# Altium schematic sheet ASB.SchDoc (part 1 of 3)
size A3
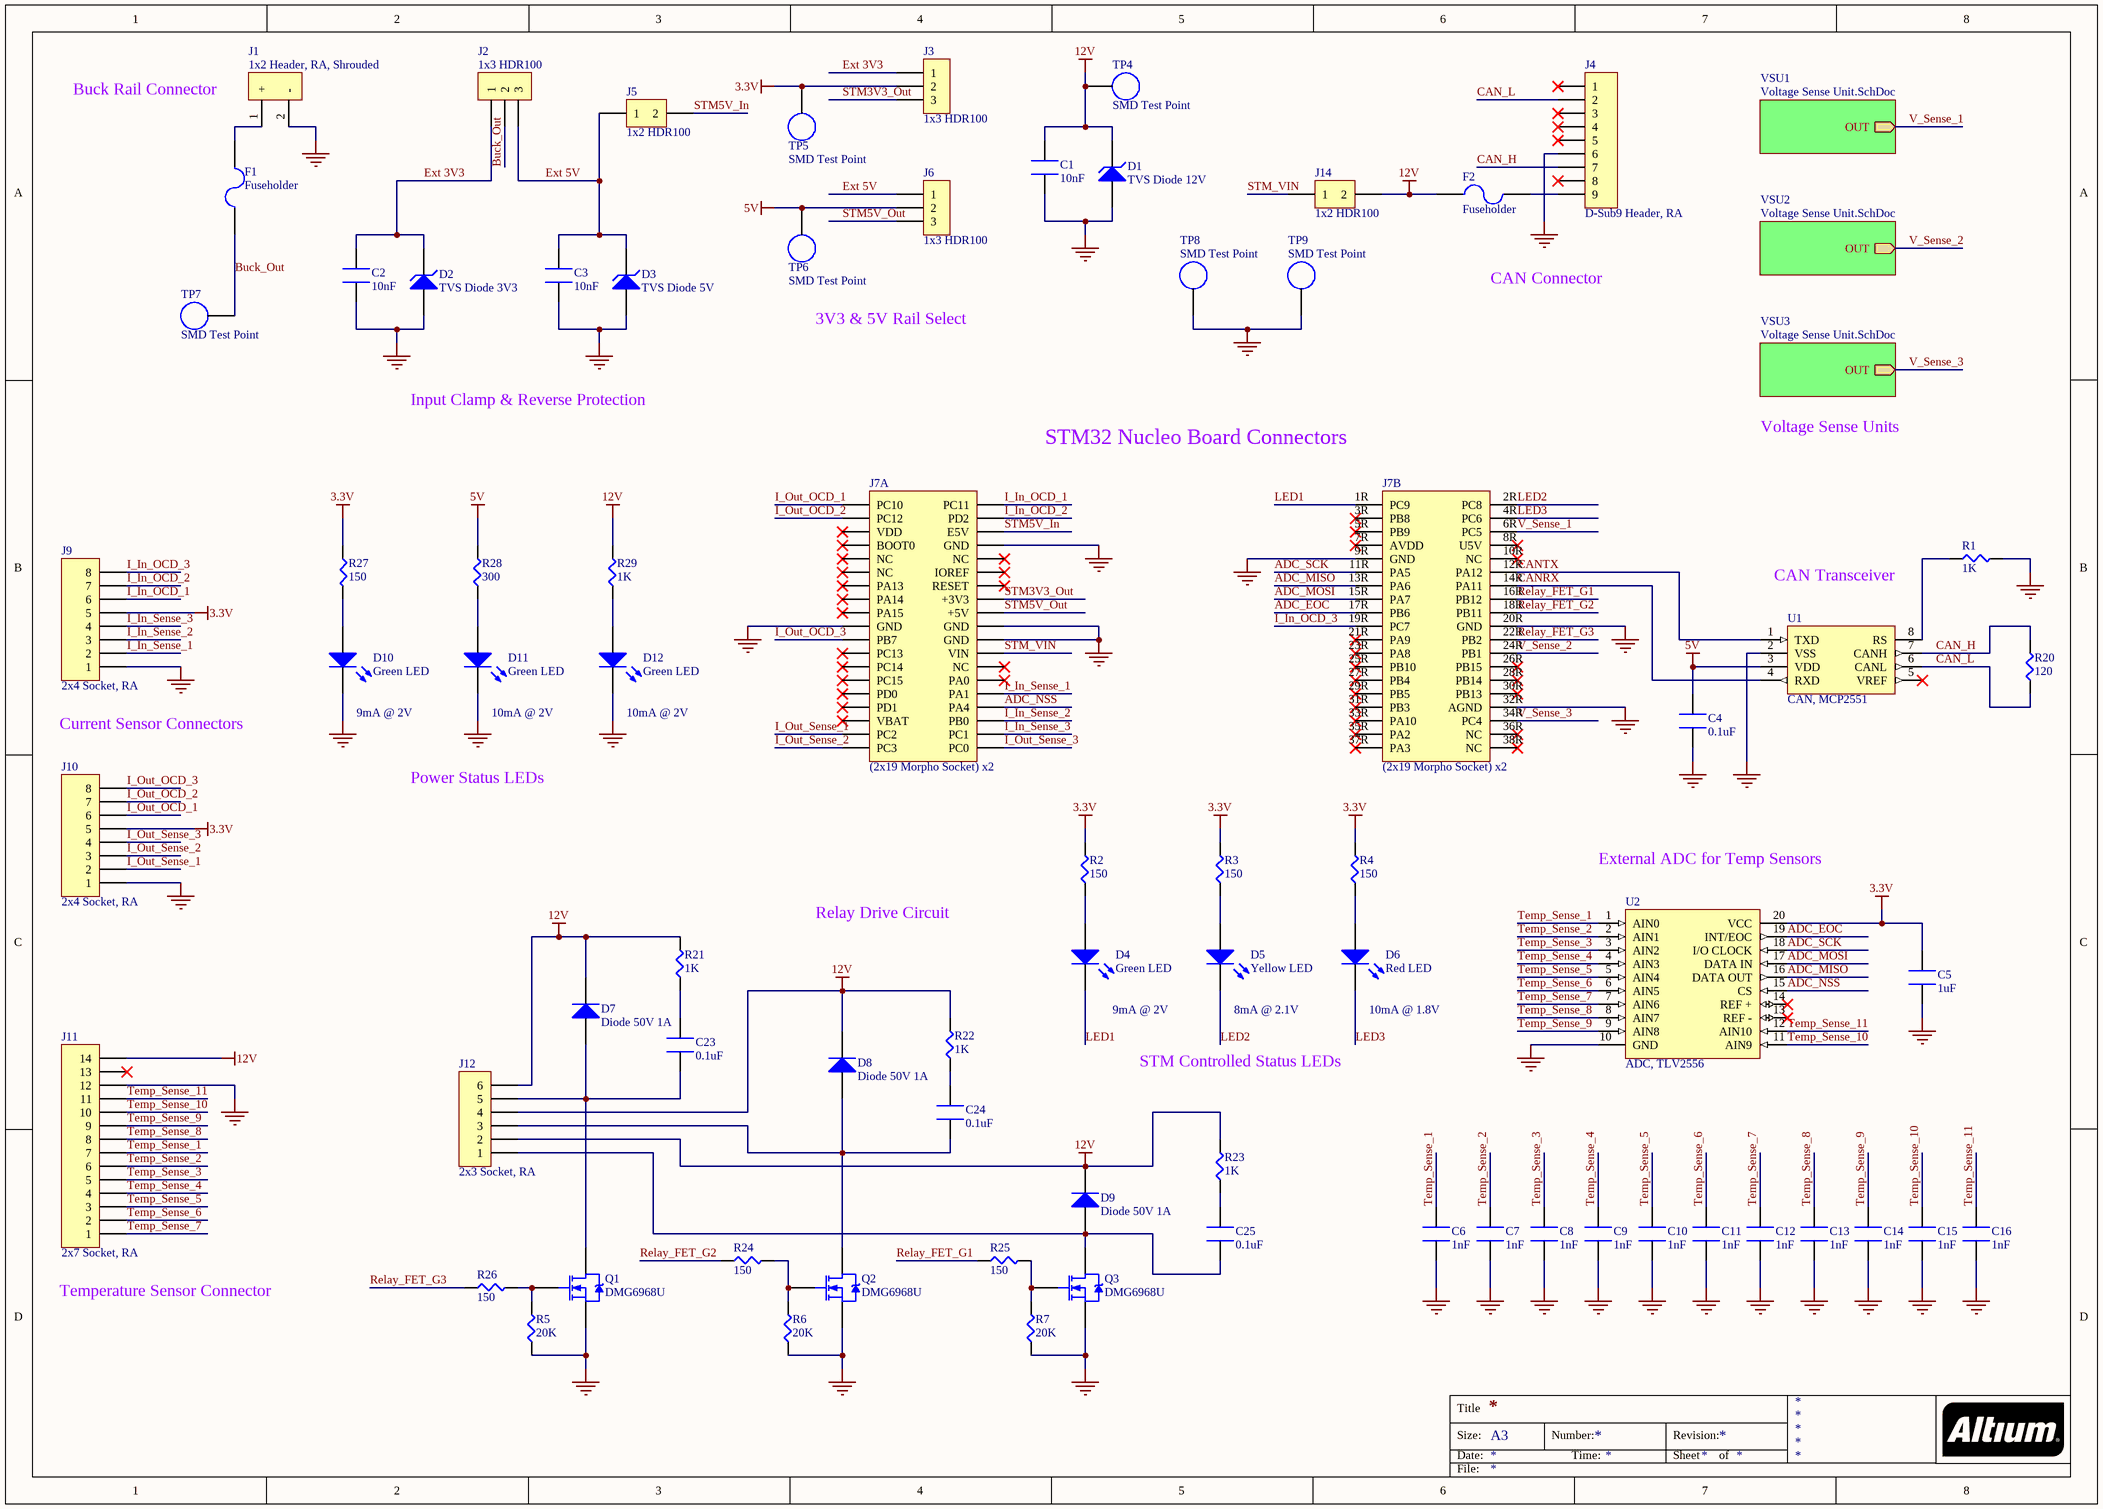
[diagram p0: ASB.SchDoc]

## Parts
C1  10nF  [C0805]
C2  10nF  [C0805]
C3  10nF  [C0805]
C4  0.1uF  [C0805]
C5  1uF  [C0805]
C6  1nF  [C0805]
C7  1nF  [C0805]
C8  1nF  [C0805]
C9  1nF  [C0805]
C10  1nF  [C0805]
C11  1nF  [C0805]
C12  1nF  [C0805]
C13  1nF  [C0805]
C14  1nF  [C0805]
C15  1nF  [C0805]
C16  1nF  [C0805]
C23  0.1uF  [C0805]
C24  0.1uF  [C0805]
C25  0.1uF  [C0805]
D1  TVS Diode 12V  [SOD-323]
D2  TVS Diode 3V3  [SOD-323]
D3  TVS Diode 5V  [SOD-323]
D4  Green LED  [L0805]
D5  Yellow LED  [L0805]
D6  Red LED  [L0805]
D7  Diode 50V 1A  [CGRKM4001-HF]
D8  Diode 50V 1A  [CGRKM4001-HF]
D9  Diode 50V 1A  [CGRKM4001-HF]
D10  Green LED  [L0805]
D11  Green LED  [L0805]
D12  Green LED  [L0805]
F1  Fuseholder  [SCHURTER - 0031.7701.11 - FUSE HOLDER, PCB MOUNT]
F2  Fuseholder  [SCHURTER - 0031.7701.11 - FUSE HOLDER, PCB MOUNT]
J1  1x2 Header, RA, Shrouded  [MOLEX_0705530001]
J2  1x3 HDR100  [MOLEX 0901200763]
J3  1x3 HDR100  [MOLEX 0901200763]
J4  D-Sub9 Header, RA  [D9 Connector]
J5  1x2 HDR100  [Molex 0901200762]
J6  1x3 HDR100  [MOLEX 0901200763]
J7  (2x19 Morpho Socket) x2  [STM32 Nucleo Footprint]]  (parts A,B of 2)
J9  2x4 Socket, RA  [Molex 105314 8 CON]
J10  2x4 Socket, RA  [Molex 105314 8 CON]
J11  2x7 Socket, RA  [MOLEX 105314 14 CON]
J12  2x3 Socket, RA  [MOLEX 105314 6 CON]
J14  1x2 HDR100  [Molex 0901200762]
Q1  DMG6968U  [MOSFET DMG6968UDICT-ND]
Q2  DMG6968U  [MOSFET DMG6968UDICT-ND]
Q3  DMG6968U  [MOSFET DMG6968UDICT-ND]
R1  1K  [R0805]
R2  150  [R0805]
R3  150  [R0805]
R4  150  [R0805]
R5  20K  [R0805]
R6  20K  [R0805]
R7  20K  [R0805]
R20  120  [R0805]
R21  1K  [R0805]
R22  1K  [R0805]
R23  1K  [R0805]
R24  150  [R0805]
R25  150  [R0805]
R26  150  [R0805]
R27  150  [R0805]
R28  300  [R0805]
R29  1K  [R0805]
TP4  SMD Test Point  [5019 Keystone SMT Test Point]
TP5  SMD Test Point  [5019 Keystone SMT Test Point]
TP6  SMD Test Point  [5019 Keystone SMT Test Point]
TP7  SMD Test Point  [5019 Keystone SMT Test Point]
TP8  SMD Test Point  [5019 Keystone SMT Test Point]
TP9  SMD Test Point  [5019 Keystone SMT Test Point]
U1  CAN, MCP2551  [LT1677IS8#TRPBF]
U2  ADC, TLV2556  [DW20-L]

## Sub-sheets
VSU1 = Voltage Sense Unit.SchDoc: OUT (out)
VSU2 = Voltage Sense Unit.SchDoc: OUT (out)
VSU3 = Voltage Sense Unit.SchDoc: OUT (out)

## Nets
3.3V: C5.2 J3.2 J9.5 J10.5 R2.2 R3.2 R4.2 R27.1 TP5.1 U2.20(VCC)
5V: C4.2 J6.2 R28.2 TP6.1 U1.3(VDD)
12V: C1.2 D1.2(K) D7.2(K) D8.2(K) D9.2(K) F2.1 J11.14 J12.2 J12.4 J12.6 J14.2 R21.2 R22.2 R23.2 R29.2 TP4.1
GND: C1.1 C2.1 C3.1 C4.1 C5.1 C6.1 C7.1 C8.1 C9.1 C10.1 C11.1 C12.1 C13.1 C14.1 C15.1 C16.1 D1.1(A) D2.1(A) D3.1(A) D10.2(K) D11.2(K) D12.2(K) J1.2(-) J4.6 J7.8L(GND) J7.9R(GND) J7.19L(GND) J7.20L(GND) J7.20R(GND) J7.22L(GND) J7.32R(AGND) J9.1 J10.1 J11.12 Q1.3(S) Q2.3(S) Q3.3(S) R1.2 R5.1 R6.1 R7.1 TP8.1 TP9.1 U1.2(VSS) U2.10(GND)
ADC_EOC: J7.17R(PB6) U2.19(INT/EOC)
ADC_MISO: J7.13R(PA6) U2.16(DATA_OUT)
ADC_MOSI: J7.15R(PA7) U2.17(DATA_IN)
ADC_NSS: J7.32L(PA4) U2.15(CS)
ADC_SCK: J7.11R(PA5) U2.18(I/O_CLOCK)
Buck_Out: F1.2 J2.2 TP7.1
CAN_H: J4.7 R20.2 U1.7(CANH)
CAN_L: J4.2 R20.1 U1.6(CANL)
CANRX: J7.14R(PA11) U1.4(RXD)
CANTX: J7.12R(PA12) U1.1(TXD)
Ext 3V3: C2.2 D2.2(K) J2.1 J3.1
Ext 5V: C3.2 D3.2(K) J2.3 J5.1 J6.1
I_In_OCD_1: J7.2L(PC11) J9.6
I_In_OCD_2: J7.4L(PD2) J9.7
I_In_OCD_3: J7.19R(PC7) J9.8
I_In_Sense_1: J7.30L(PA1) J9.2
I_In_Sense_2: J7.34L(PB0) J9.3
I_In_Sense_3: J7.36L(PC1) J9.4
I_Out_OCD_1: J7.1L(PC10) J10.6
I_Out_OCD_2: J7.3L(PC12) J10.7
I_Out_OCD_3: J7.21L(PB7) J10.8
I_Out_Sense_1: J7.35L(PC2) J10.2
I_Out_Sense_2: J7.37L(PC3) J10.3
I_Out_Sense_3: J7.38L(PC0) J10.4
LED1: D4.2(K) J7.1R(PC9)
LED2: D5.2(K) J7.2R(PC8)
LED3: D6.2(K) J7.4R(PC6)
Relay_FET_G1: J7.16R(PB12) R25.1
Relay_FET_G2: J7.18R(PB11) R24.1
Relay_FET_G3: J7.22R(PB2) R26.1
STM3V3_Out: J3.3 J7.16L(+3V3)
STM5V_In: J5.2 J7.6L(E5V)
STM5V_Out: J6.3 J7.18L(+5V)
STM_VIN: J7.24L(VIN) J14.1
Temp_Sense_1: C6.2 J11.7 U2.1(AIN0)
Temp_Sense_2: C7.2 J11.6 U2.2(AIN1)
Temp_Sense_3: C8.2 J11.5 U2.3(AIN2)
Temp_Sense_4: C9.2 J11.4 U2.4(AIN3)
Temp_Sense_5: C10.2 J11.3 U2.5(AIN4)
Temp_Sense_6: C11.2 J11.2 U2.6(AIN5)
Temp_Sense_7: C12.2 J11.1 U2.7(AIN6)
Temp_Sense_8: C13.2 J11.8 U2.8(AIN7)
Temp_Sense_9: C14.2 J11.9 U2.9(AIN8)
Temp_Sense_10: C15.2 J11.10 U2.11(AIN9)
Temp_Sense_11: C16.2 J11.11 U2.12(AIN10)
V_Sense_1: J7.6R(PC5) ; sheet VSU1/OUT
V_Sense_2: J7.24R(PB1) ; sheet VSU2/OUT
V_Sense_3: J7.34R(PC4) ; sheet VSU3/OUT
NetC23_1: C23.1 D7.1(A) J12.5 Q1.2(D)
NetC23_2: C23.2 R21.1
NetC24_1: C24.1 D8.1(A) J12.3 Q2.2(D)
NetC24_2: C24.2 R22.1
NetC25_1: C25.1 D9.1(A) J12.1 Q3.2(D)
NetC25_2: C25.2 R23.1
NetD4_1: D4.1(A) R2.1
NetD5_1: D5.1(A) R3.1
NetD6_1: D6.1(A) R4.1
NetD10_1: D10.1(A) R27.2
NetD11_1: D11.1(A) R28.1
NetD12_1: D12.1(A) R29.1
NetF1_1: F1.1 J1.1(+)
NetF2_2: F2.2 J4.9
NetQ1_1: Q1.1(G) R5.2 R26.2
NetQ2_1: Q2.1(G) R6.2 R24.2
NetQ3_1: Q3.1(G) R7.2 R25.2
NetR1_1: R1.1 U1.8(RS)

Not connected (* = marked no-connect by the designer): J4 1* 3* 4* 5* 8*; J7 3R(PB8)* 5L(VDD)* 5R(PB9)* 7L(BOOT0)* 7R(AVDD)* 8R(U5V)* 9L(NC)* 10L(NC)* 10R(NC)* 11L(NC)* 12L(IOREF)* 13L(PA13)* 14L(RESET)* 15L(PA14)* 17L(PA15)* 21R(PA9)* 23L(PC13)* 23R(PA8)* 25L(PC14)* 25R(PB10)* 26L(NC)* 26R(PB15)* 27L(PC15)* 27R(PB4)* 28L(PA0)* 28R(PB14)* 29L(PD0)* 29R(PB5)* 30R(PB13)* 31L(PD1)* 31R(PB3)* 33L(VBAT)* 33R(PA10)* 35R(PA2)* 36R(NC)* 37R(PA3)* 38R(NC)*; J11 13*; U1 5(VREF)*; U2 13(REF_-)* 14(REF_+)*

## Notes on the sheet
- (near J1) Buck Rail Connector
- CAN Connector
- 3V3 & 5V Rail Select
- Input Clamp & Reverse Protection
- STM32 Nucleo Board Connectors
- Voltage Sense Units
- CAN Transceiver
- (near D10) 9mA @ 2V
- (near D11) 10mA @ 2V
- (near D12) 10mA @ 2V
- Current Sensor Connectors
- Power Status LEDs
- Relay Drive Circuit
- External ADC for Temp Sensors
- 9mA @ 2V
- (near D5) 8mA @ 2.1V
- (near D6) 10mA @ 1.8V
- STM Controlled Status LEDs
- (near J11) Temperature Sensor Connector
- Title
- Size:
- Date:
- A3
- Number:
- Time:
- Revision:
- Sheet
- of
- File: